# EasyEDA Pro project MicronetToNMEAv3.eprj

# Schematic MicronetToNMEA v3

## Sheets
1 MCU: Board Name: Main Board; Create Date: 2025-03-17; Page Name: MCU; Project Name: MicronetToNMEAv3; Schematic Name: MicronetToNMEA v3; Update Date: 2025-11-11; Company: Rodemfr; Drawn: 17/03/2025; Page Size: A4; Reviewed: No; Version: V3.0
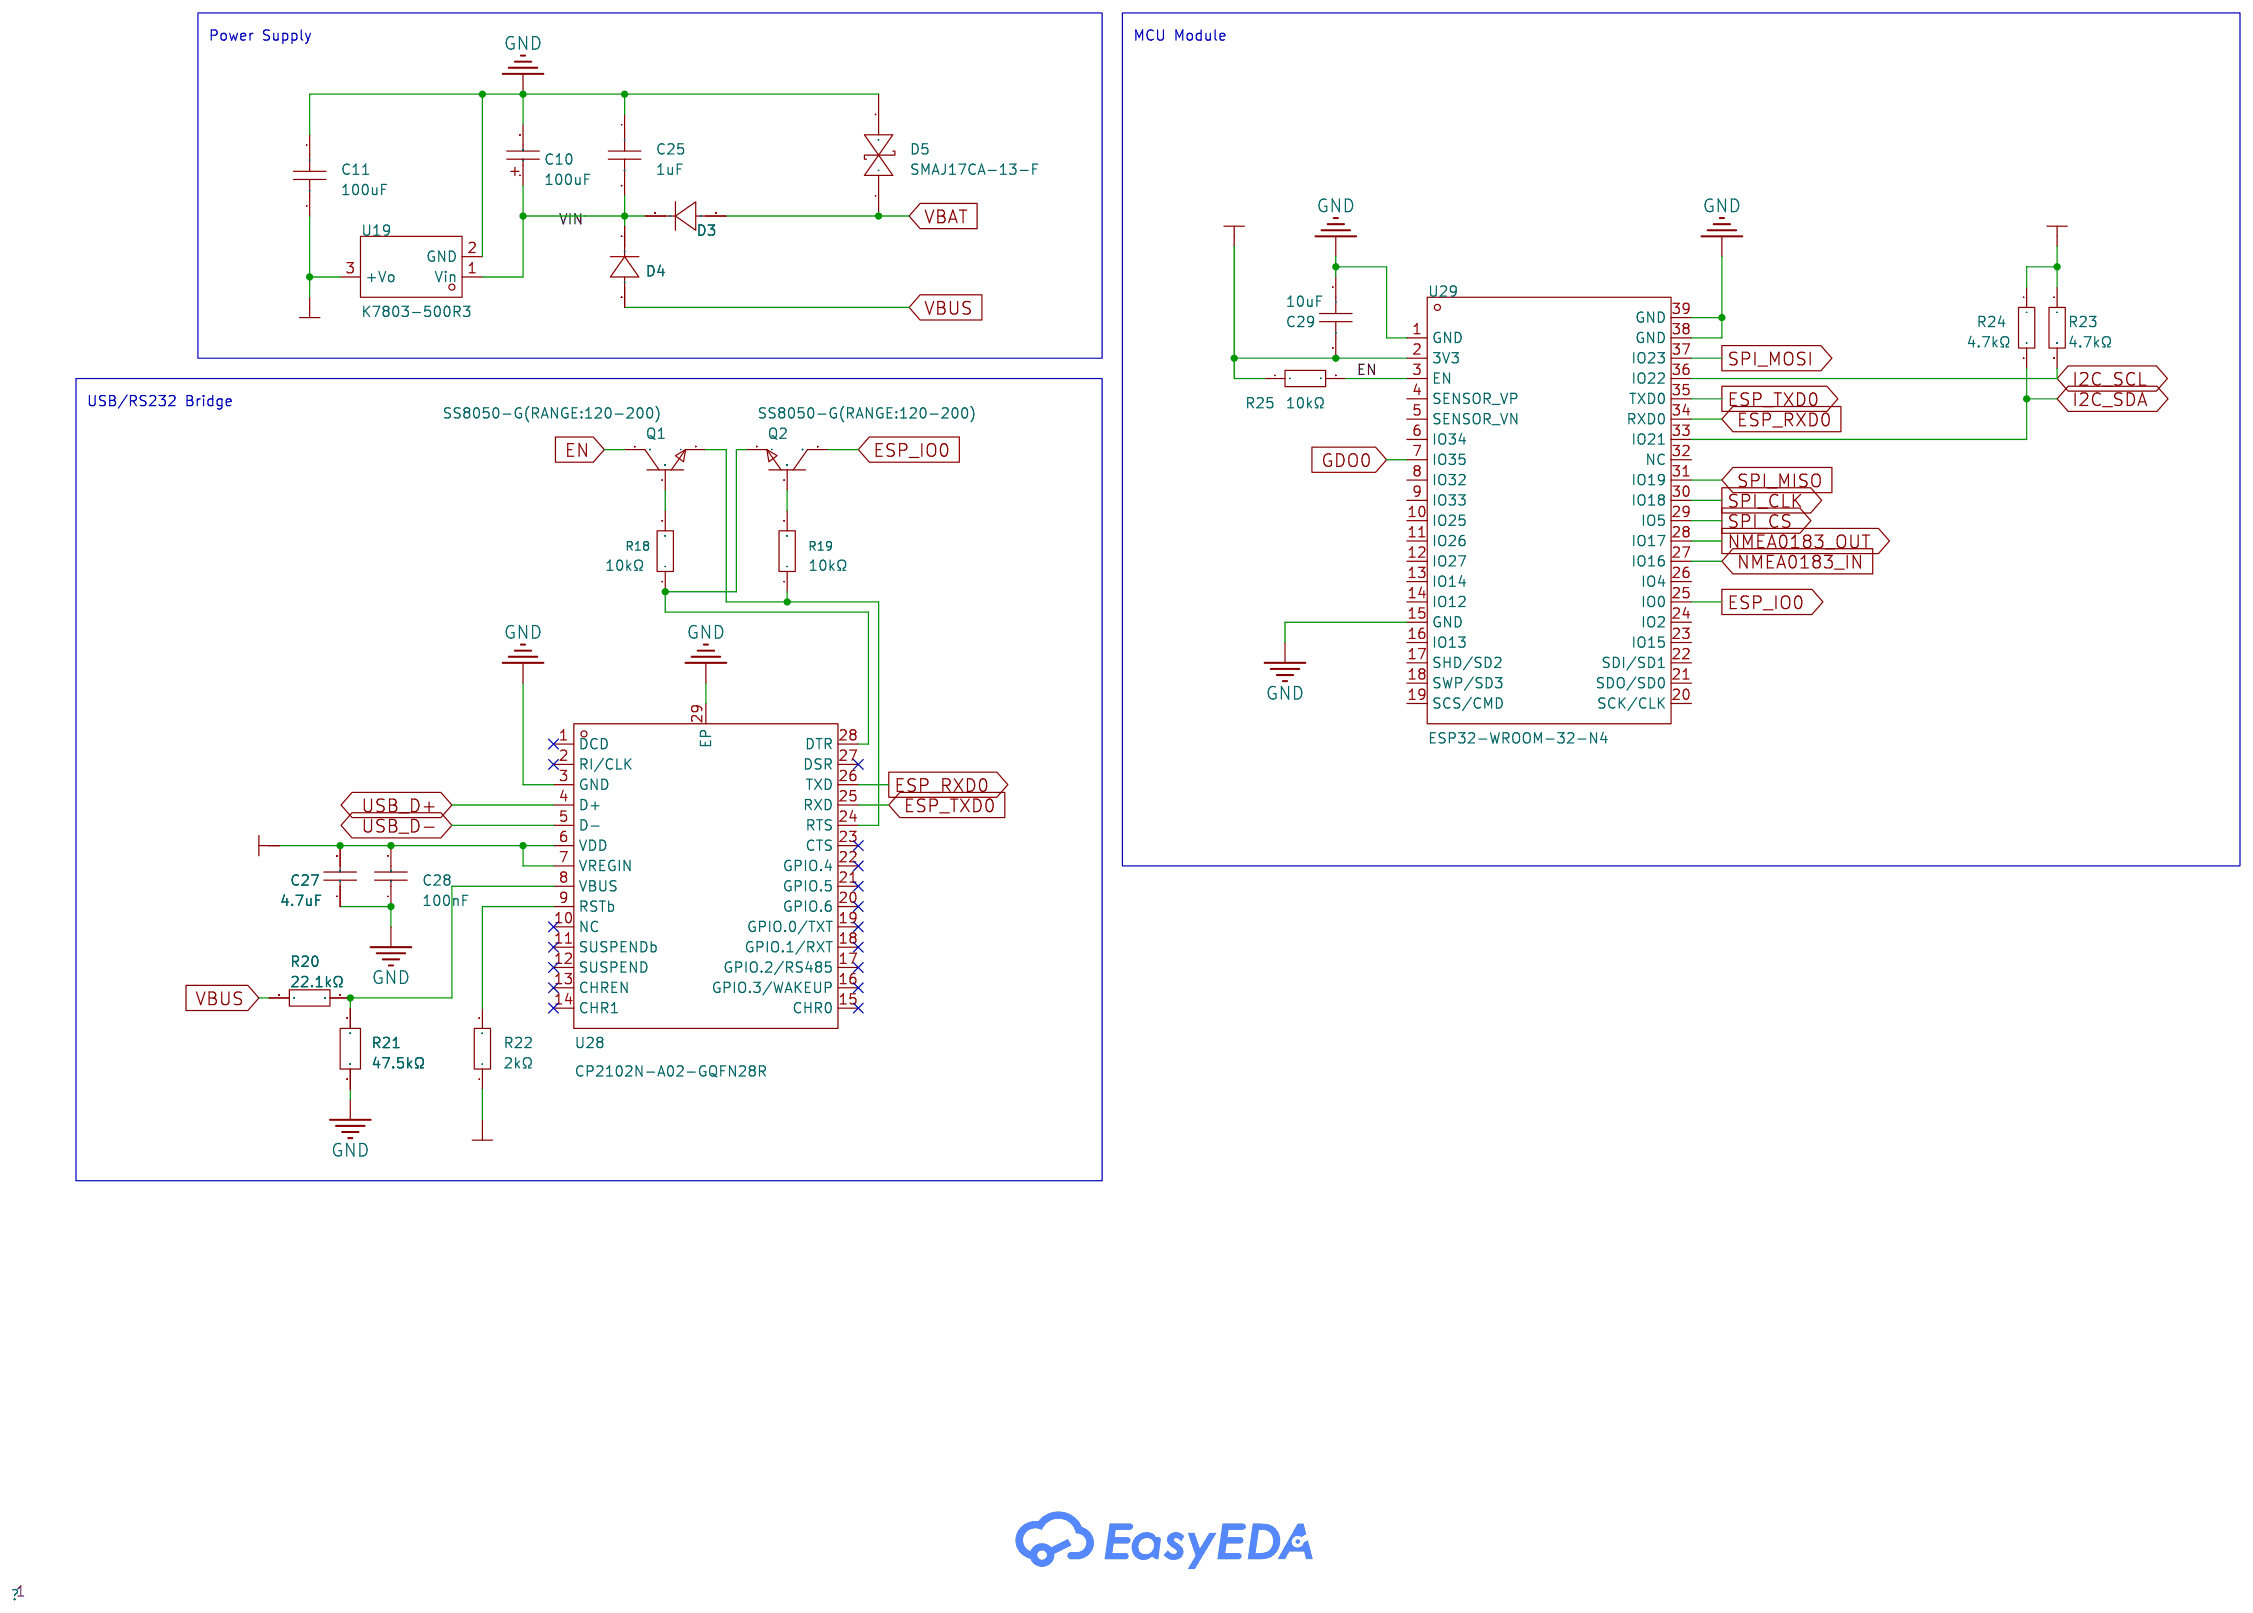
[diagram p0: MCU]
2 Peripherals: Page Name: Peripherals; Update Date: 2025-07-04; Company: EasyEDA.com
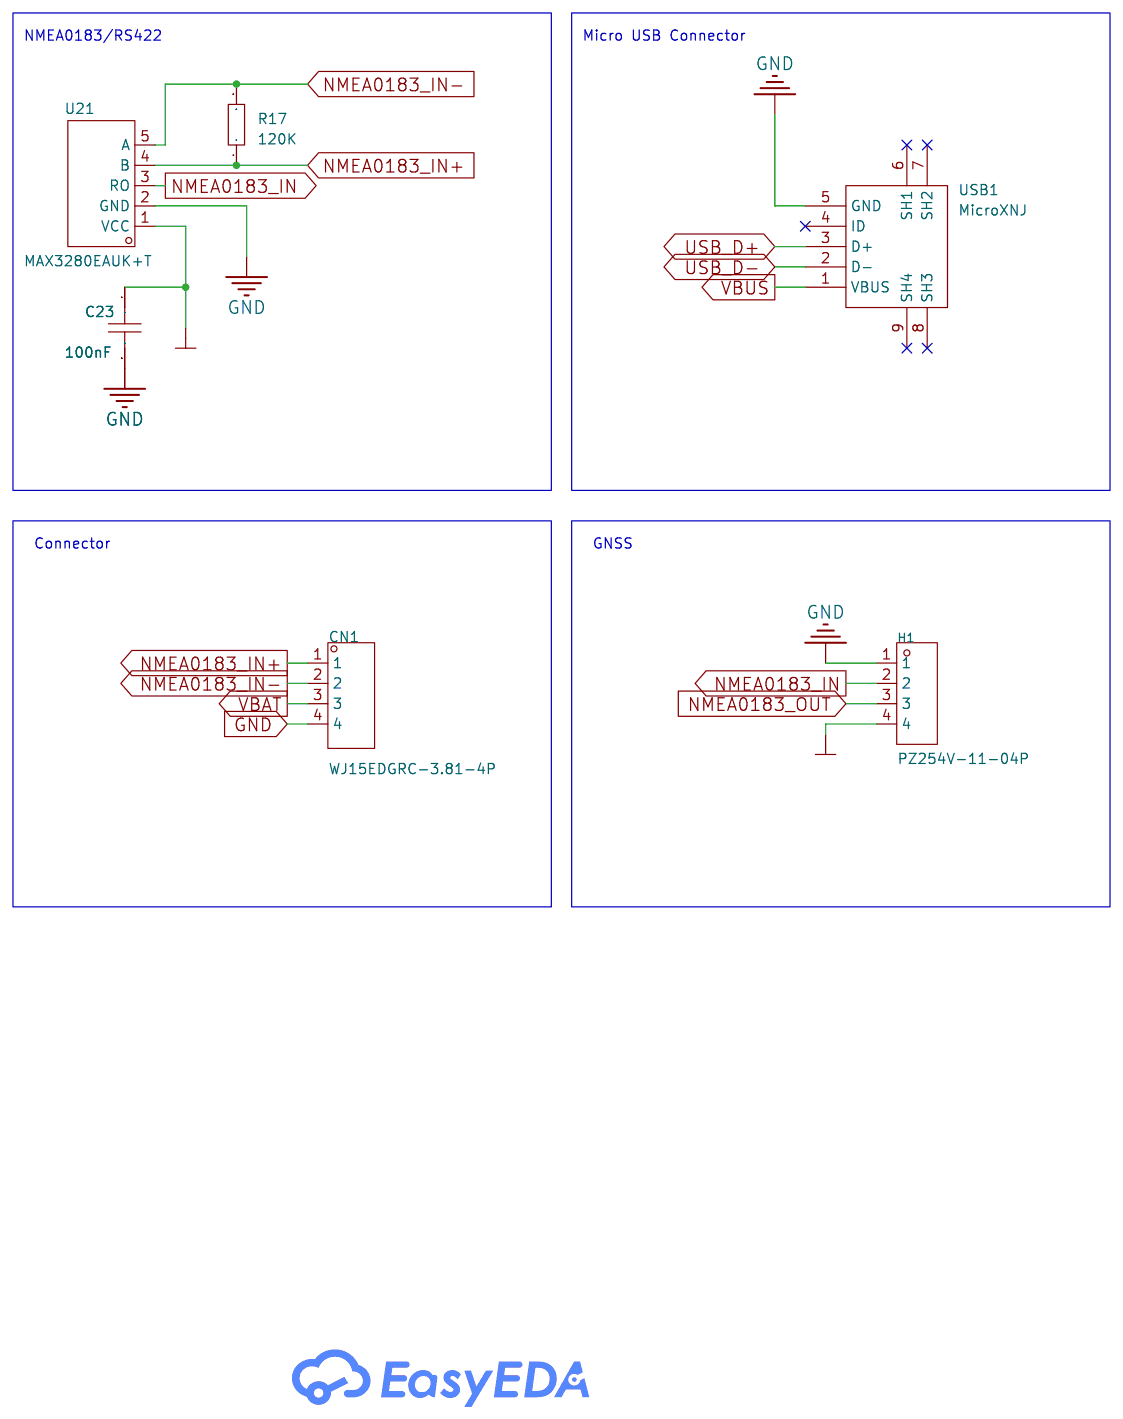
[diagram p1: Peripherals]
3 Micronet RF: Page Name: Micronet RF; Project Name: MicronetToNMEA; Update Date: 2025-03-17; Company: EasyEDA.com
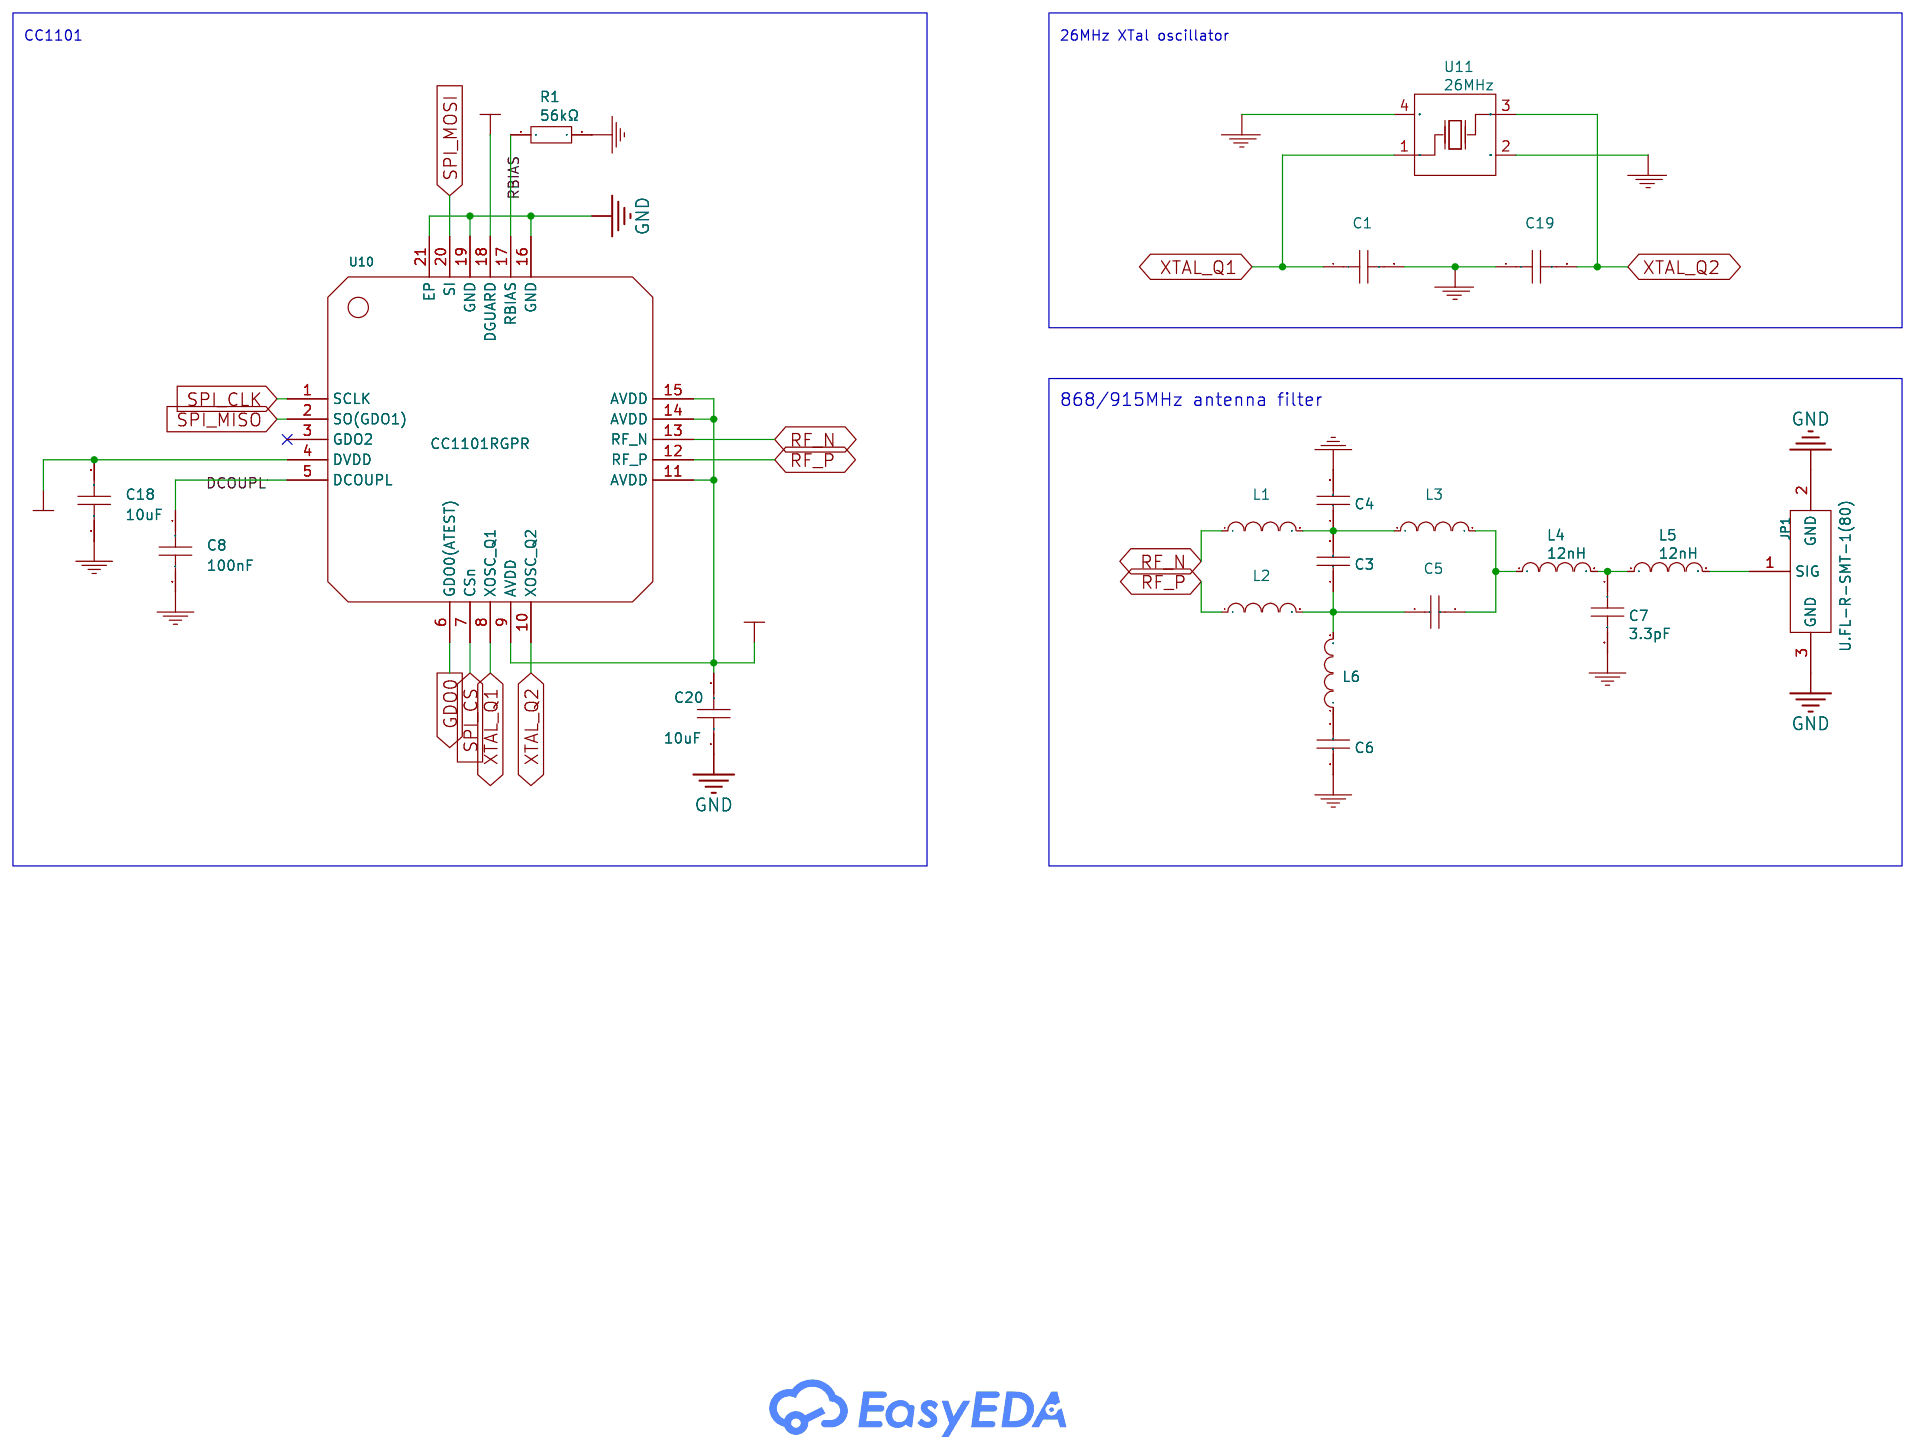
[diagram p2: Micronet RF]
4 Sensors: Page Name: Sensors; Update Date: 2025-03-23; Company: EasyEDA.com
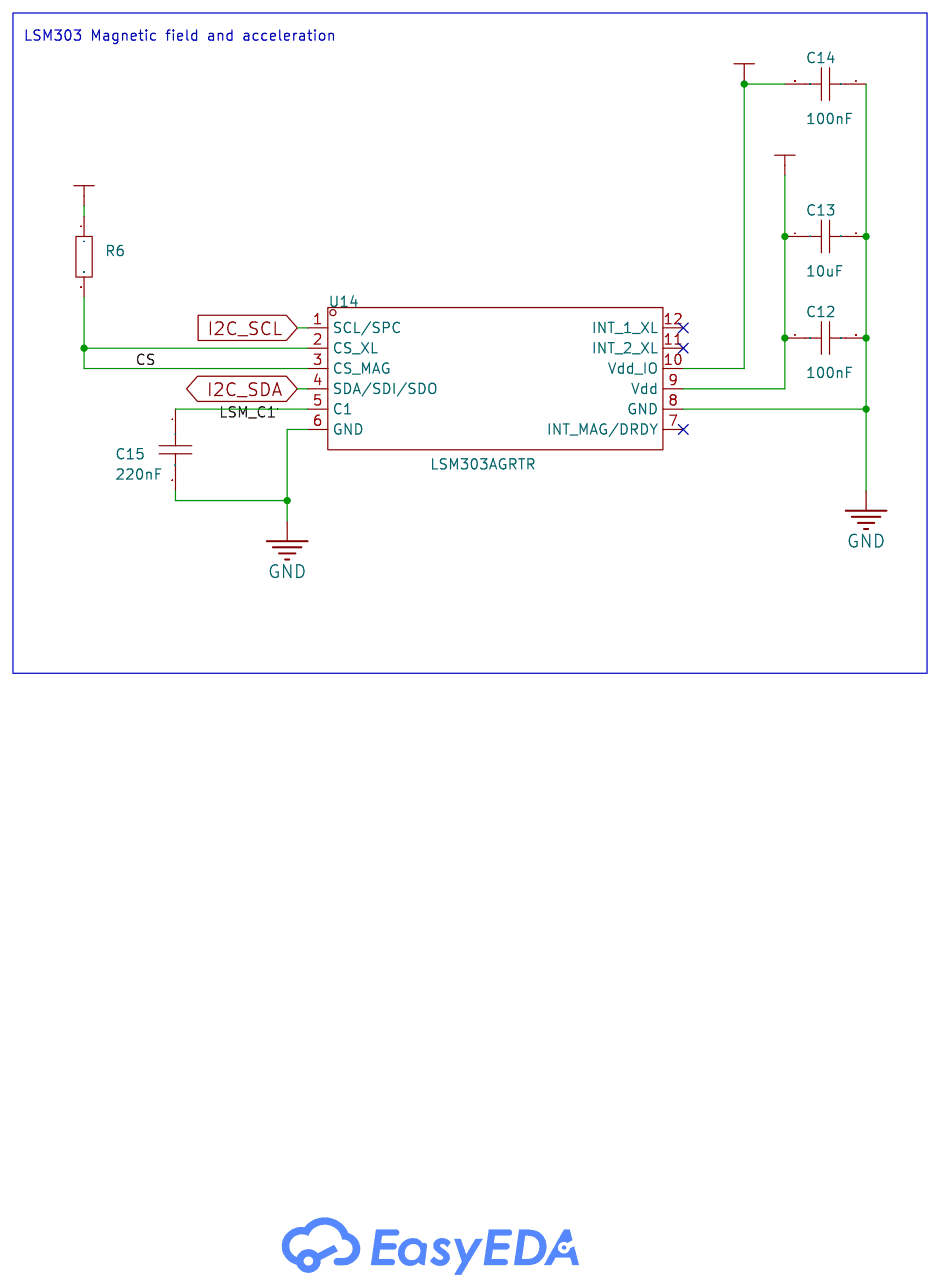
[diagram p3: Sensors]

## Parts
sheet MCU
C10  100uF  [CAP-SMD_BD8.0-L8.3-W8.3-FD]
C11  100uF  [C1210]
C25  1uF  [C0402]
C27  4.7uF  [C0603]
C28  100nF  [C0603]
C29  10uF  [C0603]
D3  1N4007WS  [SOD-323_L1.8-W1.3-LS2.5-RD]
D4  1N4007WS  [SOD-323_L1.8-W1.3-LS2.5-RD]
D5  SMAJ17CA-13-F  [SMA_L4.4-W2.6-LS5.0-BI]
Q1  SS8050-G(RANGE:120-200)  [SOT-23-3_L2.9-W1.3-P1.90-LS2.4-BR]
Q2  SS8050-G(RANGE:120-200)  [SOT-23-3_L2.9-W1.3-P1.90-LS2.4-BR]
R18  10kΩ  [R0603]
R19  10kΩ  [R0603]
R20  22.1kΩ  [R0603]
R21  47.5kΩ  [R0603]
R22  2kΩ  [R0603]
R23  4.7kΩ  [R0402]
R24  4.7kΩ  [R0402]
R25  10kΩ  [R0402]
U19  K7803-500R3  [PWRM-TH_K7803-500R3]
U28  CP2102N-A02-GQFN28R  [QFN-28_L5.0-W5.0-P0.50-TL-EP3.3]
U29  ESP32-WROOM-32-N4  [WIFIM-SMD_ESP32-WROOM-32-N4]
sheet Micronet RF
C1  27pF  [C0402]
C3  1pF  [C0402]
C4  1.5pF  [C0402]
C5  1.5pF  [C0402]
C6  100pF  [C0402]
C7  3.3pF  [C0402]
C8  100nF  [C0402]
C18  10uF  [C0402]
C19  27pF  [C0402]
C20  10uF  [C0402]
JP1  U.FL-R-SMT-1(80)  [RF-SMD_FRF05002-JSS103M]
L1  12nH  [L0402]
L2  12nH  [L0402]
L3  18nH  [L0402]
L4  12nH  [L0402]
L5  12nH  [L0402]
L6  18nH  [L0402]
R1  56kΩ  [R0402]
U10  CC1101RGPR  [QFN-20_L4.0-W4.0-P0.5-TL-EP]
U11  26MHz  [CRYSTAL-SMD_4P-L3.2-W2.5-BL]
sheet Peripherals
C23  100nF  [C0402]
CN1  WJ15EDGRC-3.81-4P  [CONN-TH_WJ15EDGRC-3.81-4P]
H1  PZ254V-11-04P  [HDR-TH_4P-P2.54-V-M]
R17  120K  [R0603]
U21  MAX3280EAUK+T  [SOT-23-5_L3.0-W1.7-P0.95-LS2.8-BL]
USB1  MicroXNJ  [MICRO-USB-SMD_MICROXNJ]
sheet Sensors
C12  100nF  [C0402]
C13  10uF  [C0402]
C14  100nF  [C0402]
C15  220nF  [C0402]
R6  10kΩ  [R0402]
U14  LSM303AGRTR  [LGA-12_L2.0-W2.0-P0.50-BL]

## Library data of the parts
C10 = EEEFK1H101P_C178548: Capacitance: Tolerance:±20% Tolerance:±20% Rated Voltage: Ripple Current:262.5mA@120Hz Equivalent Series Resistance(ESR):- φD: L: Lifetime @ Temp:5000hrs@105℃ Operating Temperature:-55℃~+105℃ Operating Temperature:-55℃~+105℃; LCSC Part Name: 100uF ±20% 50V; Supplier Part: C178548; Manufacturer: PANASONIC(松下); Manufacturer Part: EEEFK1H101P; Supplier Footprint: SMD,D8xL10.2mm; JLCPCB Part Class: Extended Part; Datasheet: https://atta.szlcsc.com/upload/public/pdf/source/20180327/C178734_B73BC829014A39870A1CD50DCE59BFEE.pdf; Supplier: LCSC; Tolerance: ±20%; Ripple Current: 262.5mA@120Hz; Lifetime @ Temp: 5000hrs@105℃; Operating Temperature: -55℃~+105℃
C11 = EMK325ABJ107MM-P: Capacitance: Tolerance:±20% Tolerance:±20% Voltage Rating: Temperature Coefficient:; LCSC Part Name: MSASE32MAB5107MPNA01 100uF ±20% 16V; Supplier Part: C90143; Manufacturer: TAIYO YUDEN(太诱); Supplier Footprint: 1210; JLCPCB Part Class: Extended Part; Datasheet: https://atta.szlcsc.com/upload/public/pdf/source/20240509/BF3467564CA221DD6EEF2C733FAD3586.pdf; Supplier: LCSC; Tolerance: ±20%
C25 = GRM155R61H105KE05D: Capacitance: Tolerance:±10% Tolerance:±10% Voltage Rated: Temperature Coefficient:; LCSC Part Name: 1uF ±10% 50V; Supplier Part: C1518208; Manufacturer: muRata(村田); Supplier Footprint: 0402; JLCPCB Part Class: Extended Part; Datasheet: https://atta.szlcsc.com/upload/public/pdf/source/20210607/3F03D47137F6EC7729AB4067EB2A6EB3.pdf; Supplier: LCSC; Tolerance: ±10%
C27 = CL10A475KQ8NNNC: LCSC Part Name: 4.7uF ±10% 6.3V; Supplier Part: C8032; Manufacturer: SAMSUNG(三星); Supplier Footprint: 0603; JLCPCB Part Class: Extended Part; Datasheet: https://item.szlcsc.com/datasheet/CL10A475KQ8NNNC/8510.html; Supplier: LCSC; Tolerance: ±10%; Voltage Rating: 6.3V; Temperature Coefficient: X5R
C28 = 0603B104K500NT_C30926: LCSC Part Name: 100nF ±10% 50V; Supplier Part: C30926; Manufacturer: FH(风华); Manufacturer Part: 0603B104K500NT; Supplier Footprint: 0603; JLCPCB Part Class: Extended Part; Datasheet: https://item.szlcsc.com/datasheet/0603B104K500NT/31683.html; Supplier: LCSC; Tolerance: ±10%; Voltage Rating: 50V; Temperature Coefficient: X7R
C29 = CL10A106MO8NQNC: Capacitance: Tolerance:±20% Tolerance:±20% Voltage Rated: Temperature Coefficient:; LCSC Part Name: 10uF ±20% 16V; Supplier Part: C92487; Manufacturer: SAMSUNG(三星); Supplier Footprint: 0603; JLCPCB Part Class: Extended Part; Datasheet: https://atta.szlcsc.com/upload/public/pdf/source/20221212/2AEE4C8656EA91AC055807CAAFF57F96.pdf; Supplier: LCSC; Tolerance: ±20%
D3 D4 = 1N4007WS_C193404: Diode Configuration: Forward Voltage (Vf@If):1.1V@1A Reverse Voltage (Vr): Rectified Current: Reverse Leakage Current:5uA@1kV; LCSC Part Name: 电压:1kV 电流:1A; Supplier Part: C193404; Manufacturer: MDD(辰达半导体); Supplier Footprint: SOD-323; JLCPCB Part Class: Extended Part; Datasheet: https://atta.szlcsc.com/upload/public/pdf/source/20230823/865291948DF6557226235927F2F58F05.pdf; Supplier: LCSC; Forward Voltage (Vf@If): 1.1V@1A; Reverse Leakage Current: 5uA@1kV
D5 = SMAJ17CA-13-F: LCSC Part Name: 双向TVS 17V截止; Supplier Part: C134964; Manufacturer: DIODES(美台); Supplier Footprint: SMA(DO-214AC); JLCPCB Part Class: Extended Part; Datasheet: https://atta.szlcsc.com/upload/public/pdf/source/20180308/C135025_15204897016241413928.pdf; Supplier: LCSC; Reverse Stand-Off Voltage (Vrwm): 17V; Maximum Clamping Voltage: 27.6V; Peak Pulse Current (Ipp): 14.5A; Peak Pulse Power Dissipation (Ppp): 400W; Breakdown Voltage: 18.9V; Type: TVS
Q1 Q2 = SS8050-G(RANGE:120-200): LCSC Part Name: L档(120-200) NPN 电流:1.5A 电压:25V; Supplier Part: C164886; Manufacturer: CJ(江苏长电/长晶); Supplier Footprint: SOT-23; JLCPCB Part Class: Extended Part; Datasheet: https://item.szlcsc.com/datasheet/SS8050-G(RANGE%253A120-200)/176268.html; Supplier: LCSC; type: NPN; Current - Collector(Ic): 1.5A; Collector - Emitter Voltage VCEO: 25V; Pd - Power Dissipation: 300mW; DC Current Gain: 120@100mA,1V; Transition frequency(fT): 100MHz; Current - Collector Cutoff: 100nA; Vce Saturation(VCE(sat)): 500mV@800mA,80mA; Operating Temperature: -55℃~+150℃; Emitter-Base Voltage(Vebo): 5V; Number: 1 NPN
R18 R19 = RMC060310K5%N: LCSC Part Name: 10kΩ ±5% 100mW; Supplier Part: C269684; Manufacturer: Tyohm(幸亚电阻); Supplier Footprint: 0603; JLCPCB Part Class: Extended Part; Datasheet: https://item.szlcsc.com/datasheet/RMC060310K5%2525N/259124.html; Supplier: LCSC; Type: Thick Film Resistor; Tolerance: ±5%; Power(Watts): 100mW; Voltage-Supply(Max): 50V; Temperature Coefficient: ±100ppm/℃; Operating Temperature: -55℃~+155℃
R20 = RC0603FR-0722K1L: LCSC Part Name: 厚膜电阻 22.1kΩ ±1% 100mW; Supplier Part: C137768; Manufacturer: YAGEO(国巨); Supplier Footprint: 0603; JLCPCB Part Class: Extended Part; Datasheet: https://item.szlcsc.com/datasheet/RC0603FR-0722K1L/149084.html; Supplier: LCSC; Type: Thick Film Resistor; Tolerance: ±1%; Power(Watts): 100mW; Voltage-Supply(Max): 75V; Temperature Coefficient: ±100ppm/℃; Operating Temperature: -55℃~+155℃
R21 = RT0603FRE0747K5L: LCSC Part Name: 薄膜电阻 47.5kΩ ±1% 100mW; Supplier Part: C706176; Manufacturer: YAGEO(国巨); Supplier Footprint: 0603; JLCPCB Part Class: Extended Part; Datasheet: https://atta.szlcsc.com/upload/public/pdf/source/20200720/C706176_7967DF4A4839E72D814B188785540CDD.pdf; Supplier: LCSC; Type: Thin Film Resistor; Tolerance: ±1%; Temperature Coefficient: ±50ppm/℃; Operating Temperature Range: -55℃~+155℃
R22 = RTT03202JTP: LCSC Part Name: 厚膜电阻 2kΩ ±5% 100mW; Supplier Part: C103396; Manufacturer: RALEC(旺诠); Supplier Footprint: 0603; JLCPCB Part Class: Extended Part; Datasheet: https://item.szlcsc.com/datasheet/RTT03202JTP/104611.html; Supplier: LCSC; Type: Thick Film Resistor; Tolerance: ±5%; Power(Watts): 100mW; Voltage-Supply(Max): 75V; Temperature Coefficient: ±100ppm/℃; Operating Temperature: -55℃~+155℃
R23 R24 = 0402WGJ0472TCE: Type:Thick Film Resistors Resistance:4.7kΩ Tolerance:±5% Tolerance:±5% Power(Watts): Overload Voltage (Max): Temperature Coefficient:±100ppm/℃ Temperature Coefficient:±100ppm/℃ Operating Temperature Range:-55℃~+155℃ Operating Temperature Range:-55℃~+155℃; LCSC Part Name: 4.7kΩ ±5% 62.5mW 厚膜电阻; Supplier Part: C25940; Manufacturer: UNI-ROYAL(厚声); Supplier Footprint: 0402; JLCPCB Part Class: Extended Part; Datasheet: https://atta.szlcsc.com/upload/public/pdf/source/20200306/C422600_1E6D84923E4A46A82E41ADD87F860B5C.pdf; Supplier: LCSC; Type: Thick Film Resistors; Tolerance: ±5%; Temperature Coefficient: ±100ppm/℃; Operating Temperature Range: -55℃~+155℃
R6 R25 = 0402WGJ0103TCE: Type:Thick Film Resistors Resistance:10kΩ Tolerance:±5% Tolerance:±5% Power(Watts): Overload Voltage (Max): Temperature Coefficient:±100ppm/℃ Temperature Coefficient:±100ppm/℃ Operating Temperature Range:-55℃~+155℃ Operating Temperature Range:-55℃~+155℃; LCSC Part Name: 10kΩ ±5% 62.5mW 厚膜电阻; Supplier Part: C25531; Manufacturer: UNI-ROYAL(厚声); Supplier Footprint: 0402; JLCPCB Part Class: Extended Part; Datasheet: https://atta.szlcsc.com/upload/public/pdf/source/20200306/C422600_1E6D84923E4A46A82E41ADD87F860B5C.pdf; Supplier: LCSC; Type: Thick Film Resistors; Tolerance: ±5%; Temperature Coefficient: ±100ppm/℃; Operating Temperature Range: -55℃~+155℃
U19 = K7803-500R3_C5369643: Supplier Part: C5369643; Manufacturer: YLPTEC(易川); Supplier Footprint: SIP,11.5x7.6mm; JLCPCB Part Class: Extended Part; Datasheet: https://atta.szlcsc.com/upload/public/pdf/source/20231130/A27A2C6619C01D10262DE302026A4639.pdf; Supplier: LCSC; Conversion Type: DC-DC; Function: Step-down type; Input Voltage(DC): 4.75V~36V; Output Voltage: 3.3V; Output Power: 1.65W; Output Current (Max): 500mA; Output Channel: 1; Conversion Efficiency: 96%; Feature: Short-Circuit  Protection; Maximum Capacitive Load: 680uF
U28 = CP2102N-A02-GQFN28R: Supplier Part: C964632; Manufacturer: SKYWORKS/SILICON LABS(芯科); Supplier Footprint: QFN-28-EP(5x5); JLCPCB Part Class: Extended Part; Datasheet: https://item.szlcsc.com/datasheet/CP2102N-A02-GQFN28R/1049893.html; Supplier: LCSC; Applications Function: USB to UART; USB Protocol: USB 2.0; Voltage - Supply: 3V~3.6V; Operating Temperature: -40℃~+85℃@(Ta); Current - Supply: 9.5mA; Supply Current (Iq): 1.3uA
U29 = ESP32-WROOM-32-N4: LCSC Part Name: WiFi+蓝牙4.2+双核CPU模块; Supplier Part: C82899; Manufacturer: ESPRESSIF(乐鑫); Supplier Footprint: SMD,18x25.5mm; JLCPCB Part Class: Extended Part; Datasheet: https://atta.szlcsc.com/upload/public/pdf/source/20241030/CCB539BBE3BF966BF47741EF6F78A315.pdf; Supplier: LCSC
C1 C19 = GJM1555C1H270FB01D: Capacitance: Tolerance:±1% Tolerance:±1% Voltage Rated: Temperature Coefficient:; LCSC Part Name: 27pF ±1% 50V; Supplier Part: C88883; Manufacturer: muRata(村田); Supplier Footprint: 0402; JLCPCB Part Class: Extended Part; Datasheet: https://atta.szlcsc.com/upload/public/pdf/source/20190904/C426118_85E81C7C1F21FC87C5FB6D536E0847B4.pdf; Supplier: LCSC; Tolerance: ±1%; Check: true
C3 = GRM1555C1H1R0CA01D: Capacitance: Voltage Rated: Temperature Coefficient:; LCSC Part Name: 1pF 50V; Supplier Part: C76953; Manufacturer: muRata(村田); Supplier Footprint: 0402; JLCPCB Part Class: Extended Part; Datasheet: https://atta.szlcsc.com/upload/public/pdf/source/20180307/C76953_15204091218821407741.pdf; Supplier: LCSC; Check: true
C4 C5 = GRM1555C1H1R5BA01D: Capacitance: Voltage Rated: Temperature Coefficient:; LCSC Part Name: 1.5pF 50V; Supplier Part: C76957; Manufacturer: muRata(村田); Supplier Footprint: 0402; JLCPCB Part Class: Extended Part; Datasheet: https://atta.szlcsc.com/upload/public/pdf/source/20180307/C76957_15204091256371407745.pdf; Supplier: LCSC; Check: true
C6 = GRM1555C1H101JA01D: Capacitance: Tolerance:±5% Tolerance:±5% Voltage Rated: Temperature Coefficient:; LCSC Part Name: 100pF ±5% 50V; Supplier Part: C77177; Manufacturer: muRata(村田); Supplier Footprint: 0402; JLCPCB Part Class: Extended Part; Datasheet: https://atta.szlcsc.com/upload/public/pdf/source/20161108/1478586482814.pdf; Supplier: LCSC; Tolerance: ±5%; Check: true
C7 = GRM1555C1H3R3CA01D: Capacitance: Voltage Rated: Temperature Coefficient:; LCSC Part Name: 3.3pF 50V; Supplier Part: C76968; Manufacturer: muRata(村田); Supplier Footprint: 0402; JLCPCB Part Class: Extended Part; Datasheet: https://atta.szlcsc.com/upload/public/pdf/source/20180326/C76968_42A943F46D0EB2822F2395CFA6966D50.pdf; Supplier: LCSC; Check: true
C8 = GRM155R62A104KE14D: Capacitance: Tolerance:±10% Tolerance:±10% Voltage Rated: Temperature Coefficient:; LCSC Part Name: 100nF ±10% 100V; Supplier Part: C162178; Manufacturer: muRata(村田); Supplier Footprint: 0402; JLCPCB Part Class: Extended Part; Datasheet: https://atta.szlcsc.com/upload/public/pdf/source/20200921/C162178_EF61A2DC43497DE67E2F462D3389BE9B.pdf; Supplier: LCSC; Tolerance: ±10%; Check: true
C18 C20 = GRM155R61A106ME44D: Capacitance: Tolerance:±20% Tolerance:±20% Voltage Rated: Temperature Coefficient:; LCSC Part Name: 10uF ±20% 10V; Supplier Part: C77000; Manufacturer: muRata(村田); Supplier Footprint: 0402; JLCPCB Part Class: Extended Part; Datasheet: https://atta.szlcsc.com/upload/public/pdf/source/20180530/C77000_4866797CFE3A842CD03C597EBD6AE6CD.pdf; Supplier: LCSC; Tolerance: ±20%
JP1 = U.FL-R-SMT-1(80)_C88374: Connector Type:板端 Interface Type:内针 Number of Ports:1 Interface Diameter:2mm Interface Length/Height:1.25mm Frequency-Max:6GHz RF Series:IPEX Impedance:50Ω Style:- Contact Material:Brass Operating Temperature Range:-40℃~+90℃ Operating Temperature Range:-4; LCSC Part Name: IPEX 内针; Supplier Part: C88374; Manufacturer: HRS(广濑); Supplier Footprint: SMD; JLCPCB Part Class: Extended Part; Datasheet: https://atta.szlcsc.com/upload/public/pdf/source/20161125/1480067868647.pdf; Supplier: LCSC; Connector Type: 板端; Interface Type: 内针; Number of Ports: 1; Interface Diameter: 2mm; Interface Length/Height: 1.25mm; Frequency-Max: 6GHz; RF Series: IPEX; Impedance: 50Ω; Contact Material: Brass; Operating Temperature Range: -40℃~+90℃; Check: true
L1 L2 = LQW15AN12NJ00D: Inductance: Tolerance:±5% Tolerance:±5% Rated Current: Saturation Current (Isat):- DC Resistance (DCR): Ratings:-; LCSC Part Name: 12nH ±5%; Supplier Part: C82920; Manufacturer: muRata(村田); Supplier Footprint: 0402; JLCPCB Part Class: Extended Part; Datasheet: https://atta.szlcsc.com/upload/public/pdf/source/20170505/1493951387766.pdf; Supplier: LCSC; Tolerance: ±5%; Check: true
L3 L6 = LQW15AN18NJ00D: Inductance: Tolerance:±5% Tolerance:±5% Rated Current: Saturation Current (Isat):- DC Resistance (DCR): Ratings:-; LCSC Part Name: 18nH ±5%; Supplier Part: C82917; Manufacturer: muRata(村田); Supplier Footprint: 0402; JLCPCB Part Class: Extended Part; Datasheet: https://atta.szlcsc.com/upload/public/pdf/source/20170325/1490427880337.pdf; Supplier: LCSC; Tolerance: ±5%; Check: true
L4 L5 = LQW15AN12NG00D: Inductance: Tolerance:±2% Tolerance:±2% Rated Current: Saturation Current (Isat):- DC Resistance (DCR): Ratings:-; LCSC Part Name: 12nH ±2%; Supplier Part: C86128; Manufacturer: muRata(村田); Supplier Footprint: 0402; JLCPCB Part Class: Extended Part; Datasheet: https://atta.szlcsc.com/upload/public/pdf/source/20161104/1478253457680.pdf; Supplier: LCSC; Tolerance: ±2%; Check: true
R1 = RK73H1ETTP5602F: Type:Thick Film Resistors Resistance: Tolerance:±1% Tolerance:±1% Power(Watts): Overload Voltage (Max): Temperature Coefficient:±100ppm/℃ Temperature Coefficient:±100ppm/℃ Operating Temperature Range:-55℃~+155℃ Operating Temperature Range:-55℃~+155℃; LCSC Part Name: 厚膜电阻 56kΩ ±1% 100mW; Supplier Part: C71703; Manufacturer: KOA; Supplier Footprint: 0402; JLCPCB Part Class: Extended Part; Datasheet: https://atta.szlcsc.com/upload/public/pdf/source/20180126/C171778_15169517982501308609.pdf; Supplier: LCSC; Type: Thick Film Resistors; Tolerance: ±1%; Temperature Coefficient: ±100ppm/℃; Operating Temperature Range: -55℃~+155℃; Check: true
U10 = CC1101RGPR: Frequency Range:779MHz~928MHz；300MHz~348MHz Frequency Range:779MHz~928MHz；300MHz~348MHz Interface:SPI Operating Voltage:1.8V~3.6V Operating Voltage:1.8V~3.6V Applications:General-purposeISM Output Power:12dBm Data Rate:600Kbps Current Of Transmitting:12.3; LCSC Part Name: 低功率射频收发器 专为极低功耗无线应用设计; Supplier Part: C29953; Manufacturer: TI(德州仪器); Supplier Footprint: QFN-20-EP(4x4); JLCPCB Part Class: Extended Part; Datasheet: https://www.ti.com/cn/lit/gpn/cc1101; Supplier: LCSC; Frequency Range: 779MHz~928MHz；300MHz~348MHz; Interface: SPI; Operating Voltage: 1.8V~3.6V; Applications: General-purposeISM; Output Power: 12dBm; Data Rate: 600Kbps; Current Of Transmitting: 12.3mA; Sensitivity: -116dBm; Receive Current: 14.3mA; Typical Application Frequency: 433MHz；315MHz; Operating Temperature: -40℃~+85℃; Check: true
U11 = S3226000151040: Crystal Type:贴片晶振 Frequency: Normal temperature Frequency Tolerance:±10ppm Normal temperature Frequency Tolerance:±10ppm External load capacitor: Equivalent Series Resistance (ESR):40Ω Operating Temperature: Operating Temperature:; LCSC Part Name: 26MHz ±10ppm 15pF; Supplier Part: C479205; Manufacturer: JGHC(晶光华); Supplier Footprint: SMD3225-4P; JLCPCB Part Class: Extended Part; Datasheet: https://atta.szlcsc.com/upload/public/pdf/source/20230522/40D5BBD3CE23FDD9A2980F79514F1325.pdf; Supplier: LCSC; Crystal Type: 贴片晶振; Normal temperature Frequency Tolerance: ±10ppm; Equivalent Series Resistance (ESR): 40Ω; Check: true
C12 C14 C23 = CL05B104KO5NNNC: Capacitance: Tolerance:±10% Tolerance:±10% Voltage Rated: Temperature Coefficient:; LCSC Part Name: 100nF ±10% 16V; Supplier Part: C1525; Manufacturer: SAMSUNG(三星); Supplier Footprint: 0402; JLCPCB Part Class: Basic Part; Datasheet: https://atta.szlcsc.com/upload/public/pdf/source/20160218/1457707763339.pdf; Supplier: LCSC; Tolerance: ±10%
CN1 = WJ15EDGRC-3.81-4P: Connector Type:Receptacle-Close fixed form:- Structure:1x4P Pitch:3.81mm Color:- Mounting Style:Bend Number of Pins:4P Number of Rows:1 Number of PINs Per Row:4 Current Rating (Max):8A Voltage Rating (Max):300V Wire Gauge - AWG:- Wire Gauge - AWG:- Wire G; LCSC Part Name: 1x4P 3.81mm 排数:1 每排P数:4; Supplier Part: C7245; Manufacturer: KANGNEX(康奈克斯电气); Supplier Footprint: 弯插,P=3.81mm; JLCPCB Part Class: Extended Part; Datasheet: https://atta.szlcsc.com/upload/public/pdf/source/20191225/C7245_837ECEBE031BAC19A7EBD4F3127022E5.pdf; Supplier: LCSC; Connector Type: Receptacle-Close; Structure: 1x4P; Pitch: 3.81mm; Mounting Style: Bend; Number of Pins: 4P; Number of Rows: 1; Number of PINs Per Row: 4; Current Rating (Max): 8A; Voltage Rating (Max): 300V; Contact Material: Brass; Contact Plating: Tin; Operating Temperature Range: -40℃~+105℃
H1 = PZ254V-11-04P: LCSC Part Name: 1x4P 间距:2.54mm 方针 直插; Supplier Part: C2691448; Manufacturer: XFCN(兴飞); Supplier Footprint: 插件,P=2.54mm; JLCPCB Part Class: Extended Part; Datasheet: https://item.szlcsc.com/datasheet/PZ254V-11-04P/2801085.html; Supplier: LCSC; Pin Structure: 1x4P; Pitch: 2.54mm; Circluar Pins/Square Pins: Pin Header; Mounting Type: Through Hole; Number of Rows: 1; Number of Pins: 4P; Current Rating: 3A; Voltage Rating (Max): 250V; Length of Mating Pin: 6mm; Insulation Height: 2.5mm; Length of End Connection Pin: 3mm; Operating Temperature: -40℃~+105℃; Color: Black
R17 = Res_0603: Supplier Footprint: 0603
U21 = MAX3280EAUK+T: Types:Receivers Number of Driver:0 Number of receiver:1 Supply Voltage:3V~5.5V Supply Voltage:3V~5.5V Data Rate:52Mbps Data Rate:52Mbps Operating Temperature:-40℃~+125℃ Operating Temperature:-40℃~+125℃; LCSC Part Name: ±15kV ESD保护，52Mbps，3V至5.5V，SOT23封装RS-485/RS-422真故障安全接收器; Supplier Part: C131126; Manufacturer: ADI(亚德诺)/MAXIM(美信); Supplier Footprint: SOT-23-5; JLCPCB Part Class: Extended Part; Datasheet: https://atta.szlcsc.com/upload/public/pdf/source/20170919/C131126_1505787254709976995.pdf; Supplier: LCSC; Types: Receivers; Number of Driver: 0; Number of receiver: 1; Supply Voltage: 3V~5.5V; Data Rate: 52Mbps; Operating Temperature: -40℃~+125℃; Check: true
USB1 = MicroXNJ: LCSC Part Name: Micro-B 母 卧贴; Supplier Part: C404969; Manufacturer: SHOU HAN(首韩); Supplier Footprint: SMD; JLCPCB Part Class: Extended Part; Datasheet: https://atta.szlcsc.com/upload/public/pdf/source/20220415/2494EDFF499AF6F852F7C820374B6AF3.pdf; Supplier: LCSC; Connector Type: Micro-B; Standard: USB 2.0; Gender: Female; Mounting Style: Horizontal attachment; Number of Contacts: 5P; Number of Ports: 1; Current Rating - Power (Max): 1.8A; Operating Temperature Range: -20℃~+85℃; Rated Voltage (Max): 30V; Connect-Disconnect Life: 5000 Cuts; Core Colour: Black
C13 = GRM155R60J106ME44D: Capacitance: Tolerance:±20% Tolerance:±20% Voltage Rated: Temperature Coefficient:; LCSC Part Name: 10uF ±20% 6.3V; Supplier Part: C76991; Manufacturer: muRata(村田); Supplier Footprint: 0402; JLCPCB Part Class: Extended Part; Datasheet: https://atta.szlcsc.com/upload/public/pdf/source/20200305/C490387_23319AE8C154DEB24C505E6C82A8106A.pdf; Supplier: LCSC; Tolerance: ±20%; Check: true
C15 = CL05B224KO5NNNC: Capacitance: Tolerance:±10% Tolerance:±10% Voltage Rated: Temperature Coefficient:; LCSC Part Name: 220nF ±10% 16V; Supplier Part: C16772; Manufacturer: SAMSUNG(三星); Supplier Footprint: 0402; JLCPCB Part Class: Basic Part; Datasheet: https://atta.szlcsc.com/upload/public/pdf/source/20160218/1457707763339.pdf; Supplier: LCSC; Tolerance: ±10%
U14 = LSM303AGRTR: Sensor Type:加速度传感器 Operating Temperature:-40℃~+85℃ Operating Temperature:-40℃~+85℃; Supplier Part: C126671; Manufacturer: ST(意法半导体); Supplier Footprint: LGA-12(2x2); JLCPCB Part Class: Extended Part; Datasheet: https://atta.szlcsc.com/upload/public/pdf/source/20180403/C126671_E4CABC5ABBEC58D74E548CEDEFA0489C.pdf; Supplier: LCSC; Sensor Type: 加速度传感器; Operating Temperature: -40℃~+85℃; Check: true

## Nets
+3.3V: C11.2 C12.1 C13.1 C14.2 C18.2 C20.2 C23.1 C27.2 C28.2 C29.2 H1.4 R6.1 R22.1 R23.1 R24.1 R25.1 U10.4(DVDD) U10.9(AVDD) U10.11(AVDD) U10.14(AVDD) U10.15(AVDD) U10.18(DGUARD) U14.9(Vdd) U14.10(Vdd_IO) U19.3(+Vo) U21.1(VCC) U28.6(VDD) U28.7(VREGIN) U29.2(3V3)
GND: C1.2 C4.2 C6.2 C7.2 C8.2 C10.2 C11.1 C12.2 C13.2 C14.1 C15.2 C18.1 C19.1 C20.1 C23.2 C25.1 C27.1 C28.1 C29.1 CN1.4 D5.2 H1.1 JP1.2(GND) JP1.3(GND) R1.2 R21.1 U10.16(GND) U10.19(GND) U10.21(EP) U11.2(GND) U11.4(GND) U14.6(GND) U14.8(GND) U19.2(GND) U21.2(GND) U28.3(GND) U28.29(EP) U29.1(GND) U29.15(GND) U29.38(GND) U29.39(GND) USB1.5(GND)
VBAT: CN1.3 D3.2(A) D5.1
VBUS: D4.2(A) R20.2 USB1.1(VBUS)
VIN: C10.1 C25.2 D3.1(K) D4.1(K) U19.1(Vin)
CS: R6.2 U14.2(CS_XL) U14.3(CS_MAG)
DCOUPL: C8.1 U10.5(DCOUPL)
EN: Q1.3(C) R25.2 U29.3(EN)
ESP_IO0: Q2.3(C) U29.25(IO0)
ESP_RXD0: U28.26(TXD) U29.34(RXD0)
ESP_TXD0: U28.25(RXD) U29.35(TXD0)
GDO0: U10.6(GDO0(ATEST)) U29.7(IO35)
I2C_SCL: R23.2 U14.1(SCL/SPC) U29.36(IO22)
I2C_SDA: R24.2 U14.4(SDA/SDI/SDO) U29.33(IO21)
LSM_C1: C15.1 U14.5(C1)
NMEA0183_IN: H1.2 U21.3(RO) U29.27(IO16)
NMEA0183_IN+: CN1.1 R17.1 U21.4(B)
NMEA0183_IN-: CN1.2 R17.2 U21.5(A)
NMEA0183_OUT: H1.3 U29.28(IO17)
RBIAS: R1.1 U10.17(RBIAS)
RF_N: L1.1 U10.13(RF_N)
RF_P: L2.1 U10.12(RF_P)
SPI_CLK: U10.1(SCLK) U29.30(IO18)
SPI_CS: U10.7(CSn) U29.29(IO5)
SPI_MISO: U10.2(SO(GDO1)) U29.31(IO19)
SPI_MOSI: U10.20(SI) U29.37(IO23)
USB_D+: U28.4(D+) USB1.3(D+)
USB_D-: U28.5(D-) USB1.2(D-)
XTAL_Q1: C1.1 U10.8(XOSC_Q1) U11.1(OSC1)
XTAL_Q2: C19.2 U10.10(XOSC_Q2) U11.3(OSC2)
$1N23077: Q1.2(E) R19.1 U28.24(RTS)
$1N23080: Q1.1(B) R18.2
$1N23084: Q2.2(E) R18.1 U28.28(DTR)
$1N23089: Q2.1(B) R19.2
$1N23504: R20.1 R21.2 U28.8(VBUS)
$1N23624: R22.2 U28.9(RSTb)
$3N1118: C3.2 C4.1 L1.2 L3.1
$3N1119: C5.1 L3.2 L4.1
$3N1120: C7.1 L4.2 L5.1
$3N1121: JP1.1(SIG) L5.2
$3N1122: C6.1 L6.1
$3N1126: C3.1 C5.2 L2.2 L6.2

Not connected (* = marked no-connect by the designer): U10 3(GDO2)*; U14 7(INT_MAG/DRDY)* 11(INT_2_XL)* 12(INT_1_XL)*; U28 1(DCD)* 2(RI/CLK)* 10(NC)* 11(SUSPENDb)* 12(SUSPEND)* 13(CHREN)* 14(CHR1)* 15(CHR0)* 16(GPIO.3/WAKEUP)* 17(GPIO.2/RS485)* 18(GPIO.1/RXT)* 19(GPIO.0/TXT)* 20(GPIO.6)* 21(GPIO.5)* 22(GPIO.4)* 23(CTS)* 27(DSR)*; U29 4(SENSOR_VP) 5(SENSOR_VN) 6(IO34) 8(IO32) 9(IO33) 10(IO25) 11(IO26) 12(IO27) 13(IO14) 14(IO12) 16(IO13) 17(SHD/SD2) 18(SWP/SD3) 19(SCS/CMD) 20(SCK/CLK) 21(SDO/SD0) 22(SDI/SD1) 23(IO15) 24(IO2) 26(IO4) 32(NC); USB1 4(ID)* 6(SH1)* 7(SH2)* 8(SH3)* 9(SH4)*

## Notes on the sheets
sheet 1
- Power Supply
- MCU Module
- USB/RS232 Bridge
sheet 2
- NMEA0183/RS422
- Micro USB Connector
- Connector
- GNSS
sheet 3
- CC1101
- 26MHz XTal oscillator
- 868/915MHz antenna filter
sheet 4
- LSM303 Magnetic field and acceleration

# Board PCB
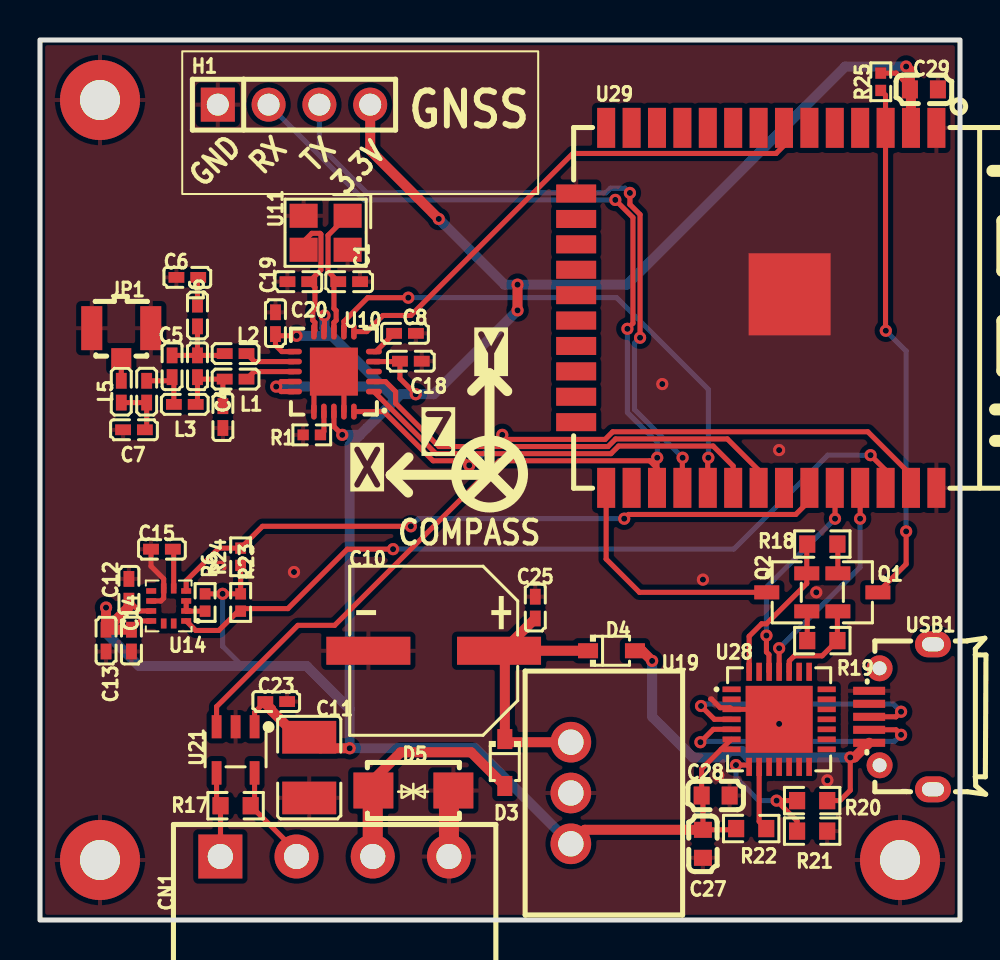
[diagram p4: board, top side]
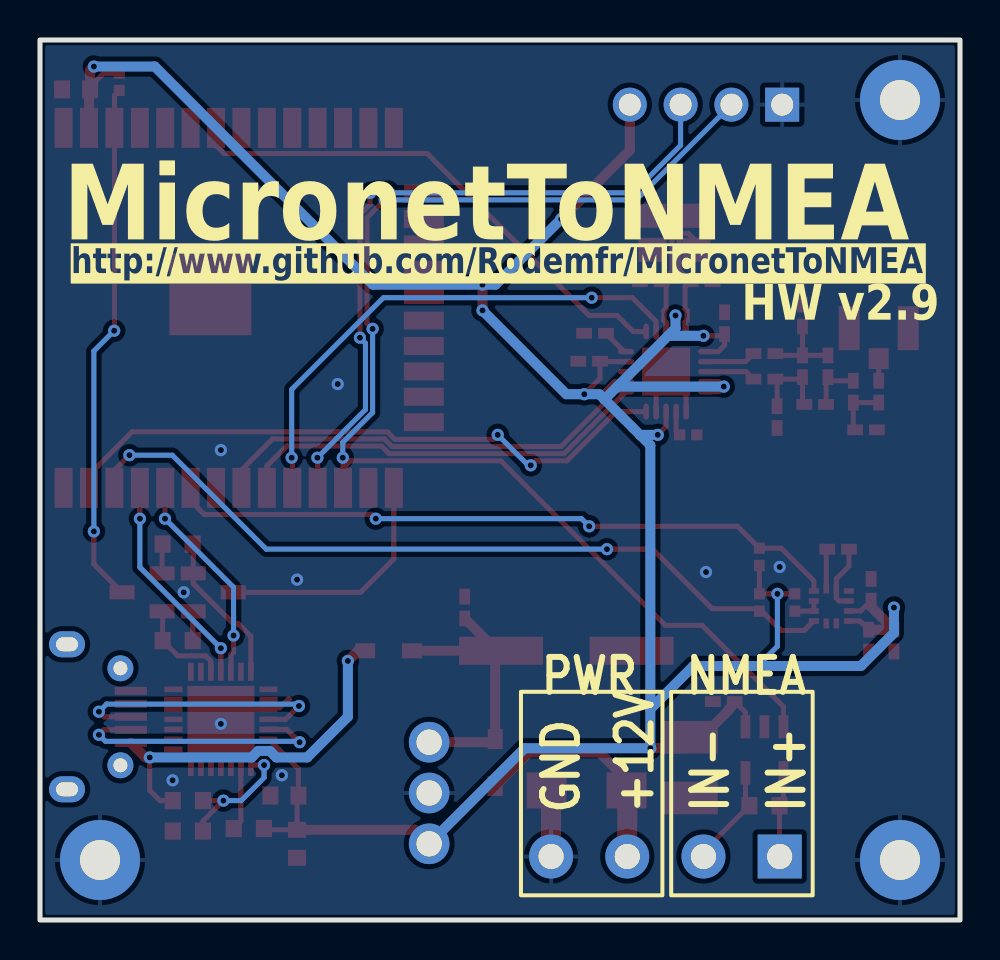
[diagram p5: board, bottom side, seen from below]

Outline 46 x 44 mm; copper layers: Top Layer, Bottom Layer. Coordinates in mm from the lower left corner of the outline.
Outline path: rectangle 0,44 46,0
Stack: Top Layer 0.035mm / Dielectric1 1.51mm FR4 er 4.5 / Bottom Layer 0.035mm

## Design rules (mm)
template: JLCPCB Capability(Two Layers Board)
spacing copperThickness1oz (default): track to track 0.102, other pairs 0.152 to 0.3
spacing copperThickness2oz: track to track 0.203, other pairs 0.152 to 0.3
track width copperThickness1oz (default): min 0.127, default 0.254, max 2.54
track width copperThickness2oz: min 0.203, default 0.254, max 2.54
differential pair differentialPair (default): width min 0.127, default 0.254, max 2.54; gap min 0.152, default 0.152
via viaSize (default): diameter min 0.5, default 0.61, max 10; hole min 0.3, default 0.305, max 6.3

## Placement (name value [footprint] x y rotation side)
C1  27pF  [C0402]  15.46 31.92 0 top
C3  1pF  [C0402]  7.87 27.69 270 top
C4  1.5pF  [C0402]  9.14 25.15 270 top
C5  1.5pF  [C0402]  6.6 27.69 90 top
C6  100pF  [C0402]  7.37 32.13 180 top
C7  3.3pF  [C0402]  4.7 24.51 180 top
C8  100nF  [C0402]  18.25 29.33 0 top
C10  100uF  [CAP-SMD_BD8.0-L8.3-W8.3-FD]  19.69 13.46 180 top
C11  100uF  [C1210]  13.46 7.62 90 top
C12  100nF  [C0402]  4.44 16.51 90 top
C13  10uF  [C0402]  3.3 13.97 270 top
C14  100nF  [C0402]  4.57 13.97 90 top
C15  220nF  [C0402]  6.1 18.54 180 top
C18  10uF  [C0402]  18.54 27.94 180 top
C19  27pF  [C0402]  12.92 31.92 0 top
C20  10uF  [C0402]  11.77 29.84 270 top
C23  100nF  [C0402]  11.81 10.92 0 top
C25  1uF  [C0402]  24.76 15.62 270 top
C27  4.7uF  [C0603]  33.15 3.81 90 top
C28  100nF  [C0603]  33.78 6.22 180 top
C29  10uF  [C0603]  44.2 41.53 180 top
CN1  WJ15EDGRC-3.81-4P  [CONN-TH_WJ15EDGRC-3.81-4P]  14.73 3.17 0 top
D3  1N4007WS  [SOD-323_L1.8-W1.3-LS2.5-RD]  23.24 7.87 270 top
D4  1N4007WS  [SOD-323_L1.8-W1.3-LS2.5-RD]  28.57 13.46 0 top
D5  SMAJ17CA-13-F  [SMA_L4.4-W2.6-LS5.0-BI]  18.67 6.48 0 top
H1  PZ254V-11-04P  [HDR-TH_4P-P2.54-V-M]  12.7 40.77 0 top
JP1  U.FL-R-SMT-1(80)  [RF-SMD_FRF05002-JSS103M]  4.06 28.83 0 top
L1  12nH  [L0402]  9.78 27.04 180 top
L2  12nH  [L0402]  9.78 28.32 180 top
L3  18nH  [L0402]  7.24 25.78 180 top
L4  12nH  [L0402]  5.33 26.42 270 top
L5  12nH  [L0402]  4.06 26.42 90 top
L6  18nH  [L0402]  7.87 30.23 270 top
NOREF  -  [Pad_e227]  3 3 0 top
NOREF#2  -  [Pad_e3082]  3 41 0 top
NOREF#3  -  [Pad_e219]  43 3 0 top
Q1  SS8050-G(RANGE:120-200)  [SOT-23-3_L2.9-W1.3-P1.90-LS2.4-BR]  40.89 16.38 180 top
Q2  SS8050-G(RANGE:120-200)  [SOT-23-3_L2.9-W1.3-P1.90-LS2.4-BR]  37.34 16.38 0 top
R1  56kΩ  [R0402]  13.59 24.26 180 top
R6  10kΩ  [R0402]  8.25 15.88 270 top
R17  120K  [R0603]  9.78 5.72 0 top
R18  10kΩ  [R0603]  39.12 18.8 0 top
R19  10kΩ  [R0603]  39.12 13.97 180 top
R20  22.1kΩ  [R0603]  38.61 5.97 0 top
R21  47.5kΩ  [R0603]  38.61 4.44 180 top
R22  2kΩ  [R0603]  35.56 4.57 0 top
R23  4.7kΩ  [R0402]  10.03 15.88 270 top
R24  4.7kΩ  [R0402]  10.03 18.16 90 top
R25  10kΩ  [R0402]  42.04 41.91 270 top
U10  CC1101RGPR  [QFN-20_L4.0-W4.0-P0.5-TL-EP]  14.69 27.42 180 top
U11  26MHz  [CRYSTAL-SMD_4P-L3.2-W2.5-BL]  14.28 34.36 180 top
U14  LSM303AGRTR  [LGA-12_L2.0-W2.0-P0.50-BL]  6.44 15.7 90 top
U19  K7803-500R3  [PWRM-TH_K7803-500R3]  26.54 6.35 270 top
U21  MAX3280EAUK+T  [SOT-23-5_L3.0-W1.7-P0.95-LS2.8-BL]  9.78 8.51 180 top
U28  CP2102N-A02-GQFN28R  [QFN-28_L5.0-W5.0-P0.50-TL-EP3.3]  36.96 10.03 0 top
U29  ESP32-WROOM-32-N4  [WIFIM-SMD_ESP32-WROOM-32-N4]  35.81 30.61 270 top
USB1  MicroXNJ  [MICRO-USB-SMD_MICROXNJ]  43.05 10.16 90 top

## Footprints (pads in the part's own frame, mm; a bottom-side part is the same pattern mirrored in y, then rotated)
C0402
  rect 0.79x0.54 smd: 1(-0.545,0) 2(0.545,0)
C0603
  rect 0.8x0.9 smd: 1(-0.7,0) 2(0.7,0)
C1210
  rect 1.635x2.7 smd: 1(-1.518,0) 2(1.518,0)
CAP-SMD_BD8.0-L8.3-W8.3-FD
  rect 4.2x1.4 smd: 1(-3.267,0) 2(3.267,0)
CONN-TH_WJ15EDGRC-3.81-4P
  rect 2.2x2.2 hole 1.26: 1(-5.715,0)
  round 2.2 hole 1.26: 2(-1.905,0) 3(1.905,0) 4(5.715,0)
CRYSTAL-SMD_4P-L3.2-W2.5-BL
  rect 1.4x1.2 smd: 1(-1.1,-0.85) 2(1.1,-0.85) 3(1.1,0.85) 4(-1.1,0.85)
HDR-TH_4P-P2.54-V-M
  rect 1.7x1.7 hole 1.1: 1(-3.81,0)
  round 1.7 hole 1.1: 2(-1.27,0) 3(1.27,0) 4(3.81,0)
L0402
  rect 0.79x0.54 smd: 1(-0.545,0) 2(0.545,0)
LGA-12_L2.0-W2.0-P0.50-BL
  rect 0.28x0.5 smd: 1(-0.75,-0.875) 2(-0.25,-0.875) 3(0.25,-0.875) 4(0.75,-0.875) 7(0.75,0.875) 8(0.25,0.875) 9(-0.25,0.875) 10(-0.75,0.875)
  rect 0.5x0.28 smd: 5(0.875,-0.25) 6(0.875,0.25) 11(-0.875,0.25) 12(-0.875,-0.25)
MICRO-USB-SMD_MICROXNJ
  rect 0.4x1.6 smd: 1(-1.3,1.597) 2(-0.65,1.597) 3(0,1.597) 4(0.65,1.597) 5(1.3,1.597)
  round 1.3 hole 0.7: 6(2.425,1.074) 9(-2.425,1.073)
  oval 1.3x1.8 hole 0.7x1.1: 7(3.625,-1.597) 8(-3.625,-1.597)
Pad_e219
  round 4 hole 2: 1(0,0)
Pad_e227
  round 4 hole 2: 1(0,0)
Pad_e3082
  round 4 hole 2: 1(0,0)
PWRM-TH_K7803-500R3
  round 2.032 hole 1.27: 1(-2.54,0) 2(0,0) 3(2.54,0)
QFN-20_L4.0-W4.0-P0.5-TL-EP
  oval 0.8x0.28 smd: 1(-2,1) 2(-2,0.5) 3(-2,0) 4(-2,-0.5) 5(-2,-1) 11(2,-1) 12(2,-0.5) 13(2,0) 14(2,0.5) 15(2,1)
  oval 0.28x0.8 smd: 6(-1,-2) 7(-0.5,-2) 8(0,-2) 9(0.5,-2) 10(1,-2) 16(1,2) 17(0.5,2) 18(0,2) 19(-0.5,2) 20(-1,2)
  rect 2.4x2.4 smd: 21(0,0)
QFN-28_L5.0-W5.0-P0.50-TL-EP3.3
  rect 0.905x0.28 smd: 1(-2.377,1.5) 2(-2.377,1) 3(-2.377,0.5) 4(-2.377,0) 5(-2.377,-0.5) 6(-2.377,-1) 7(-2.377,-1.5) 15(2.377,-1.5) 16(2.377,-1) 17(2.377,-0.5) 18(2.377,0) 19(2.377,0.5) 20(2.377,1) 21(2.377,1.5)
  rect 0.28x0.905 smd: 8(-1.5,-2.377) 9(-1,-2.377) 10(-0.5,-2.377) 11(0,-2.377) 12(0.5,-2.377) 13(1,-2.377) 14(1.5,-2.377) 22(1.5,2.377) 23(1,2.377) 24(0.5,2.377) 25(0,2.377) 26(-0.5,2.377) 27(-1,2.377) 28(-1.5,2.377)
  rect 3.35x3.35 smd: 29(0,0)
R0402
  rect 0.566x0.54 smd: 1(-0.433,0) 2(0.433,0)
R0603
  rect 0.806x0.864 smd: 1(-0.753,0) 2(0.753,0)
RF-SMD_FRF05002-JSS103M
  rect 1x1.05 smd: 1(0,-0.762)
  rect 1.05x2.2 smd: 2(-1.475,0.762) 3(1.475,0.762)
SMA_L4.4-W2.6-LS5.0-BI
  rect 2x1.8 smd: 1(-2,0) 2(2,0)
SOD-323_L1.8-W1.3-LS2.5-RD
  rect 1x0.75 smd: 1(-1.173,0) 2(1.173,0)
SOT-23-3_L2.9-W1.3-P1.90-LS2.4-BR
  rect 1.25x0.7 smd: 1(1,-0.95) 2(1,0.95) 3(-1,0)
SOT-23-5_L3.0-W1.7-P0.95-LS2.8-BL
  rect 0.49x1.157 smd: 1(-0.95,-1.153) 2(0,-1.153) 3(0.95,-1.153)
  rect 0.49x1.175 smd: 4(0.95,1.153) 5(-0.95,1.153)
WIFIM-SMD_ESP32-WROOM-32-N4
  rect 2x0.9 smd: 1(-9,9.005) 2(-9,7.735) 3(-9,6.465) 4(-9,5.195) 5(-9,3.925) 6(-9,2.655) 7(-9,1.385) 8(-9,0.115) 9(-9,-1.155) 10(-9,-2.425) 11(-9,-3.695) 12(-9,-4.965) 13(-9,-6.235) 14(-9,-7.505) 25(9,-7.505) 26(9,-6.235) 27(9,-4.965) 28(9,-3.695) 29(9,-2.425) 30(9,-1.155) 31(9,0.115) 32(9,1.385) 33(9,2.655) 34(9,3.925) 35(9,5.195) 36(9,6.465) 37(9,7.735) 38(9,9.005)
  rect 0.9x2 smd: 15(-5.715,-9.005) 16(-4.445,-9.005) 17(-3.175,-9.005) 18(-1.905,-9.005) 19(-0.635,-9.005) 20(0.635,-9.005) 21(1.905,-9.005) 22(3.175,-9.005) 23(4.445,-9.005) 24(5.715,-9.005)
  rect 4.1x4.1 smd: 39(-0.68,1.665)

## Nets
As in the schematic, except:
GND: C1.2 C4.2 C6.2 C7.2 C8.2 C10.2 C11.1 C12.2 C13.2 C14.1 C15.2 C18.1 C19.1 C20.1 C23.2 C25.1 C27.1 C28.1 C29.1 CN1.4 D5.2 H1.1 JP1.2 JP1.3 NOREF.1 NOREF#2.1 NOREF#3.1 R1.2 R21.1 U10.16 U10.19 U10.21 U11.2 U11.4 U14.6 U14.8 U19.2 U21.2 U28.3 U28.29 U29.1 U29.15 U29.38 U29.39 USB1.5

Pads without a net: U10 3; U14 7 11 12; U28 1 2 10 11 12 13 14 15 16 17 18 19 20 21 22 23 27; U29 4 5 6 8 9 10 11 12 13 14 16 17 18 19 20 21 22 23 24 26 32; USB1 4 6 7 8 9

## Via types
v1: diameter 0.61, hole 0.305, Top Layer to Bottom Layer, 49 vias

## Routing (per net, layer and track width the routed paths; a pad name or vN(x,y) marks a point on that pad's centre or on a via; arc(x,y) is an arc through that point)
+3.3V: length 155.7
  Top Layer w0.254: U28.6 34.56,9.03 34.06,8.53 ; v1(14.22,30.23) 14.22,29.45 14.19,29.42 ; U21.1 10.73,10.39 C23.1 ; v1(18.79,26.29) 18,27.08 C18.2 17.98,27.92 U10.4 ; 43.5,41.66 42.81,42.34 R25.1 ; R22.1 34.74,4.51 C27.2 33.15,6.16 C28.2 33.08,7.56 34.06,8.53 ; 34.06,8.53 U28.7 ; U14.10 5.01,14.95 C14.2 ; 14.69,25.42 14.69,24.67 v1(15.11,24.26) ; v1(12.83,29.21) 11.86,29.21 C20.2 11.77,28.74 12.09,28.42 12.69,28.42 ; R6.1 v1(9.13,16.31) 9.91,16.31 10.03,16.44 R24.1 ; U14.9 4.96,15.45 C12.1 ; 12.69,26.42 12.06,26.42 v1(11.81,26.67) 12.06,26.92 U10.14
  Top Layer w0.5: H1.4 16.51,38.48 v1(19.94,35.05) ; C13.1 v1(3.3,15.62) ; C13.1 4.44,15.66 C12.1 ; C13.1 C14.2 ; U19.3 27.24,4.51 C27.2 ; v1(43.31,42.67) 43.5,42.48 43.5,41.66 43.55,41.61 43.55,39.61 ; v1(23.88,30.48) v1(23.88,31.77) ; v1(15.48,8.59) 14.01,8.59 C11.2 12.91,9.14 11.56,10.49 11.56,10.54 11.27,10.83 C23.1
  Bottom Layer w0.254: 10.12,12.7 9.13,13.69 v1(9.13,16.31)
  Bottom Layer w0.5: 15.48,10.55 13.33,12.7 4.95,12.7 3.3,14.35 v1(3.3,15.62) ; 15.48,10.55 15.48,23.74 16,24.26 ; 15.48,10.55 v1(15.48,8.59) 21.77,8.59 U19.3 ; v1(43.31,42.67) 40.26,42.67 29.35,31.77 v1(23.88,31.77) 23.22,31.77 v1(19.94,35.05) ; 17.78,26.03 16,24.26 ; 17.78,26.03 17.13,26.67 ; 17.78,26.03 18.03,26.29 v1(18.79,26.29) 19.69,26.29 v1(23.88,30.48) ; 17.13,26.67 v1(11.81,26.67) ; 17.13,26.67 14.59,29.21 ; 16,24.26 v1(15.11,24.26) ; 14.59,29.21 14.22,29.58 v1(14.22,30.23) ; 14.59,29.21 v1(12.83,29.21)
GND: length 15.3
  Top Layer w0.254: U14.8 6.05,15.95 6.19,16.09 U14.6 6.19,17.06 5.55,17.69 C15.2 ; U28.29 36.46,10.53 U28.3 34.5,10.61 34.01,10.61 33.58,11.05 33.53,11.05 ; 15.19,25.42 15.19,26.92 14.69,27.42 13.69,26.42 13.69,25.42
  Top Layer w1: CN1.4 20.45,6.25 D5.2
  vias: v1(9.02,17.65) v1(12.7,17.4) v1(31.12,26.8) v1(33.15,17.02) v1(33.91,7.24) v1(36.96,23.5) v1(36.96,9.81) v1(38.81,16.38) v1(39.37,6.98)
VBAT: length 11.7
  Top Layer w0.5: D5.1 16.67,7.02 18.03,8.38 21.56,8.38 D3.2
  Top Layer w1: D5.1 16.64,6.44 CN1.3
VBUS: length 19.1
  Top Layer w0.254: R20.2 40,5.97 40.51,6.49 v1(40.51,8.13)
  Top Layer w0.5: D4.2 30.1,13.46 v1(30.61,12.95) ; USB1.1 40.72,8.13 v1(40.51,8.13)
  Bottom Layer w0.5: v1(40.51,8.13) 35.42,8.13 35.09,8.45 34.5,8.45 34.18,8.13 32.64,8.13 30.61,10.16 v1(30.61,12.95)
VIN: length 14.4
  Top Layer w0.5: C10.1 23.24,13.17 D3.1 23.4,8.89 U19.1 ; D4.1 23.15,13.46 C25.2
CS: length 1.4
  Top Layer w0.254: U14.3 U14.2 7.32,15.44 R6.2
DCOUPL: length 1.4
  Top Layer w0.254: C8.1 16.79,28.42 16.69,28.42
EN: length 26.2
  Top Layer w0.254: R25.2 42.28,41.24 42.28,29.48 v1(42.29,29.46) ; v1(43.31,19.43) 43.31,17.8 Q1.3
  Bottom Layer w0.254: v1(43.31,19.43) 43.31,28.45 v1(42.29,29.46)
ESP_IO0: length 12.3
  Top Layer w0.254: Q2.3 29.97,16.38 28.31,18.05 28.31,21.61
ESP_RXD0: length 10.7
  Top Layer w0.254: v1(36.32,14.22) 36.32,13.4 36.45,13.27 36.45,12.42 U28.26 ; v1(39.75,20.07) 39.75,21.59 39.74,21.61
  Bottom Layer w0.254: v1(36.32,14.22) 36.32,16.64 v1(39.75,20.07)
ESP_TXD0: length 10.9
  Top Layer w0.254: U28.25 v1(36.96,13.59) ; 41.01,20.07 41.01,21.61
  Bottom Layer w0.254: v1(36.96,13.59) 41,17.64 v1(41,20.07)
GDO0: length 26.2
  Top Layer w0.254: 15.69,29.42 16.34,29.42 17.15,30.23 18.54,30.23 26.64,38.33 36.8,38.33 37.2,38.72 37.2,39.61
I2C_SCL: length 40
  Top Layer w0.254: 42.28,21.61 42.28,22.49 v1(41.53,23.24) ; U14.1 7.78,14.48 8.94,14.48 10.03,15.57 12.39,15.57 15.37,18.54 v1(17.65,18.54)
  Bottom Layer w0.254: v1(41.53,23.24) 39.39,23.24 34.69,18.54 v1(17.65,18.54)
I2C_SDA: length 34
  Top Layer w0.254: v1(18.54,19.69) 11.12,19.69 R24.2 8.94,18.59 7.31,16.96 U14.4 ; 38.47,21.61 38.47,20.96 37.79,20.28 29.42,20.28 v1(29.21,20.07)
  Bottom Layer w0.254: v1(29.21,20.07) 18.92,20.07 v1(18.54,19.69)
LSM_C1: length 2
  Top Layer w0.254: U14.5 6.69,18.5 C15.1
NMEA0183_IN: length 63.1
  Top Layer w0.254: 30.85,21.61 30.85,22.59 ; 30.85,22.59 30.85,23.1 v1(30.86,23.11) ; 30.85,22.59 30.48,22.96 22.96,22.96 14.73,14.73 12.89,14.73 8.83,10.67 U21.3 ; v1(29.37,29.56) 29.65,29.84 29.65,35.12 v1(28.77,36)
  Bottom Layer w0.254: v1(29.37,29.56) 29.37,25.37 30.86,23.88 v1(30.86,23.11) ; v1(28.77,36) 16.19,36 H1.2
NMEA0183_IN+: length 4.3
  Top Layer w0.254: U21.4 8.83,5.91 R17.1 9.03,3.18 CN1.1
NMEA0183_IN-: length 5.2
  Top Layer w0.254: U21.5 10.73,5.91 R17.2 12.83,3.42 CN1.2
NMEA0183_OUT: length 34.8
  Top Layer w0.254: 32.12,21.61 32.12,23.1 v1(32.13,23.11) ; v1(30,29.11) 30,35.27 29.5,35.78 v1(29.5,36.35)
  Bottom Layer w0.254: v1(29.5,36.35) 29.26,36.59 28.52,36.59 28.3,36.36 16.34,36.36 13.97,38.73 H1.3 ; v1(30,29.11) 29.73,28.84 29.73,25.52 v1(32.13,23.11)
RBIAS: length 1.2
  Top Layer w0.254: 14.19,25.42 14.19,24.43 R1.1
RF_N: length 2.5
  Top Layer w0.254: 12.69,27.42 10.7,27.42 L1.1
RF_P: length 2.5
  Top Layer w0.254: U10.12 10.72,27.92 L2.1
SPI_CLK: length 20.9
  Top Layer w0.254: 16.69,26.42 19.8,23.32 28.55,23.32 28.93,23.7 33.66,23.7 34.66,22.7 34.66,21.61
SPI_CS: length 26.1
  Top Layer w0.254: v1(18.41,31.11) 16.38,31.11 15.19,29.93 15.19,29.42 ; v1(33.42,23.11) 33.39,23.08 33.39,21.61
  Bottom Layer w0.254: v1(18.41,31.11) 28.83,31.11 33.42,26.53 v1(33.42,23.11)
SPI_MISO: length 22.6
  Top Layer w0.254: U10.2 17.27,26.92 17.78,26.42 17.78,25.84 19.95,23.67 28.4,23.67 28.78,24.05 34.37,24.05 35.93,22.49 35.93,21.61
SPI_MOSI: length 31.4
  Top Layer w0.254: 15.69,25.42 17.19,25.42 19.65,22.96 21.24,22.96 v1(21.46,22.73) ; v1(23.11,24.26) 23.34,24.03 28.25,24.03 28.63,24.41 41.39,24.41 43.55,22.26 43.55,21.61
  Bottom Layer w0.254: v1(21.46,22.73) 21.59,22.73 v1(23.11,24.26)
USB_D+: length 13.7
  Top Layer w0.254: v1(33.05,10.7) 33.72,10.03 U28.4 ; v1(43.05,10.41) 42.8,10.16 USB1.3
  Bottom Layer w0.254: v1(43.05,10.41) 42.67,10.8 33.15,10.8 v1(33.05,10.7)
USB_D-: length 13.7
  Top Layer w0.254: v1(43.05,9.26) 42.8,9.51 USB1.2 ; U28.5 33.66,9.53 v1(33.02,8.89)
  Bottom Layer w0.254: v1(33.02,8.89) 33.06,8.93 42.73,8.93 v1(43.05,9.26)
XTAL_Q1: length 6.6
  Top Layer w0.254: 14.69,29.42 14.69,29.87 14.81,29.98 14.81,30.47 14.69,30.58 14.69,31.7 C1.1 14.4,32.43 14.4,34.23 U11.1
XTAL_Q2: length 6.8
  Top Layer w0.254: U11.3 13.18,33.92 13.59,34.33 14,34.33 14.04,34.29 14.04,32.5 C19.2 13.75,31.63 13.75,30.58 13.64,30.47 13.64,29.98 13.75,29.88 13.75,29.47 13.69,29.42
$1N23077: length 4.8
  Top Layer w0.254: Q1.2 39.87,15.41 R19.1 39.11,13.21 37.72,13.21 37.47,12.95 37.47,12.42 U28.24
$1N23080: length 1.5
  Top Layer w0.254: R18.2 39.89,18.77 Q1.1
$1N23084: length 7.7
  Top Layer w0.254: R18.1 38.34,18.77 Q2.2 38.34,16.82 36.32,14.81 36.08,14.81 35.46,14.19 U28.28
$1N23089: length 1.5
  Top Layer w0.254: Q2.1 38.36,15.41 R19.2
$1N23504: length 6.8
  Top Layer w0.254: R20.1 v1(36.83,5.97) 37.85,4.94 R21.2 ; v1(34.8,7.75) 35.37,7.75 U28.8
  Bottom Layer w0.254: v1(36.83,5.97) 35.94,5.97 34.8,7.11 v1(34.8,7.75)
$1N23624: length 3.2
  Top Layer w0.254: R22.2 35.96,4.93 U28.9
$3N1118: length 4.2
  Top Layer w0.254: L3.1 7.87,25.87 C3.2 7.97,27.04 L1.2 9.14,26.95 C4.1
$3N1119: length 2.7
  Top Layer w0.254: L3.2 6.69,27.05 C5.1 6.42,26.96 L4.1
$3N1120: length 2.7
  Top Layer w0.254: L5.1 L4.2 5.33,24.6 C7.1
$3N1121: length 1.1
  Top Layer w0.254: L5.2 JP1.1
$3N1122: length 1.4
  Top Layer w0.254: C6.1 7.87,32.09 L6.1
$3N1126: length 4.1
  Top Layer w0.254: C3.1 9.14,28.23 L2.2 ; C3.1 L6.2 ; C3.1 C5.2

## Copper pours and planes (outline as drawn; the poured copper is in the pictures)
GND on Top Layer: -0.63,44.58 46.61,44.58 46.61,-0.51 -0.63,-0.51
GND on Top Layer: 34.8,33.91 40.13,33.91 40.13,28.7 34.8,28.7
GND on Bottom Layer: -1.14,45.08 47.12,45.08 47.12,-0.76 -1.14,-0.76

## Text on the board
Bottom Silkscreen Layer: IN+ | IN- | +12V | GND | NMEA | PWR | http://www.github.com/Rodemfr/MicronetToNMEA | HW v2.9 | MicronetToNMEA
Top Silkscreen Layer: GND | RX | TX | 3.3V | COMPASS | X | Z | Y | GNSS
